# EasyEDA schematic Schematic.json

## Sheets
1 MAIN: TITLE: New Schematic; REV: 1.0; Date: 2018-05-05; Sheet: 1/1; Drawn By: ridvanaltun
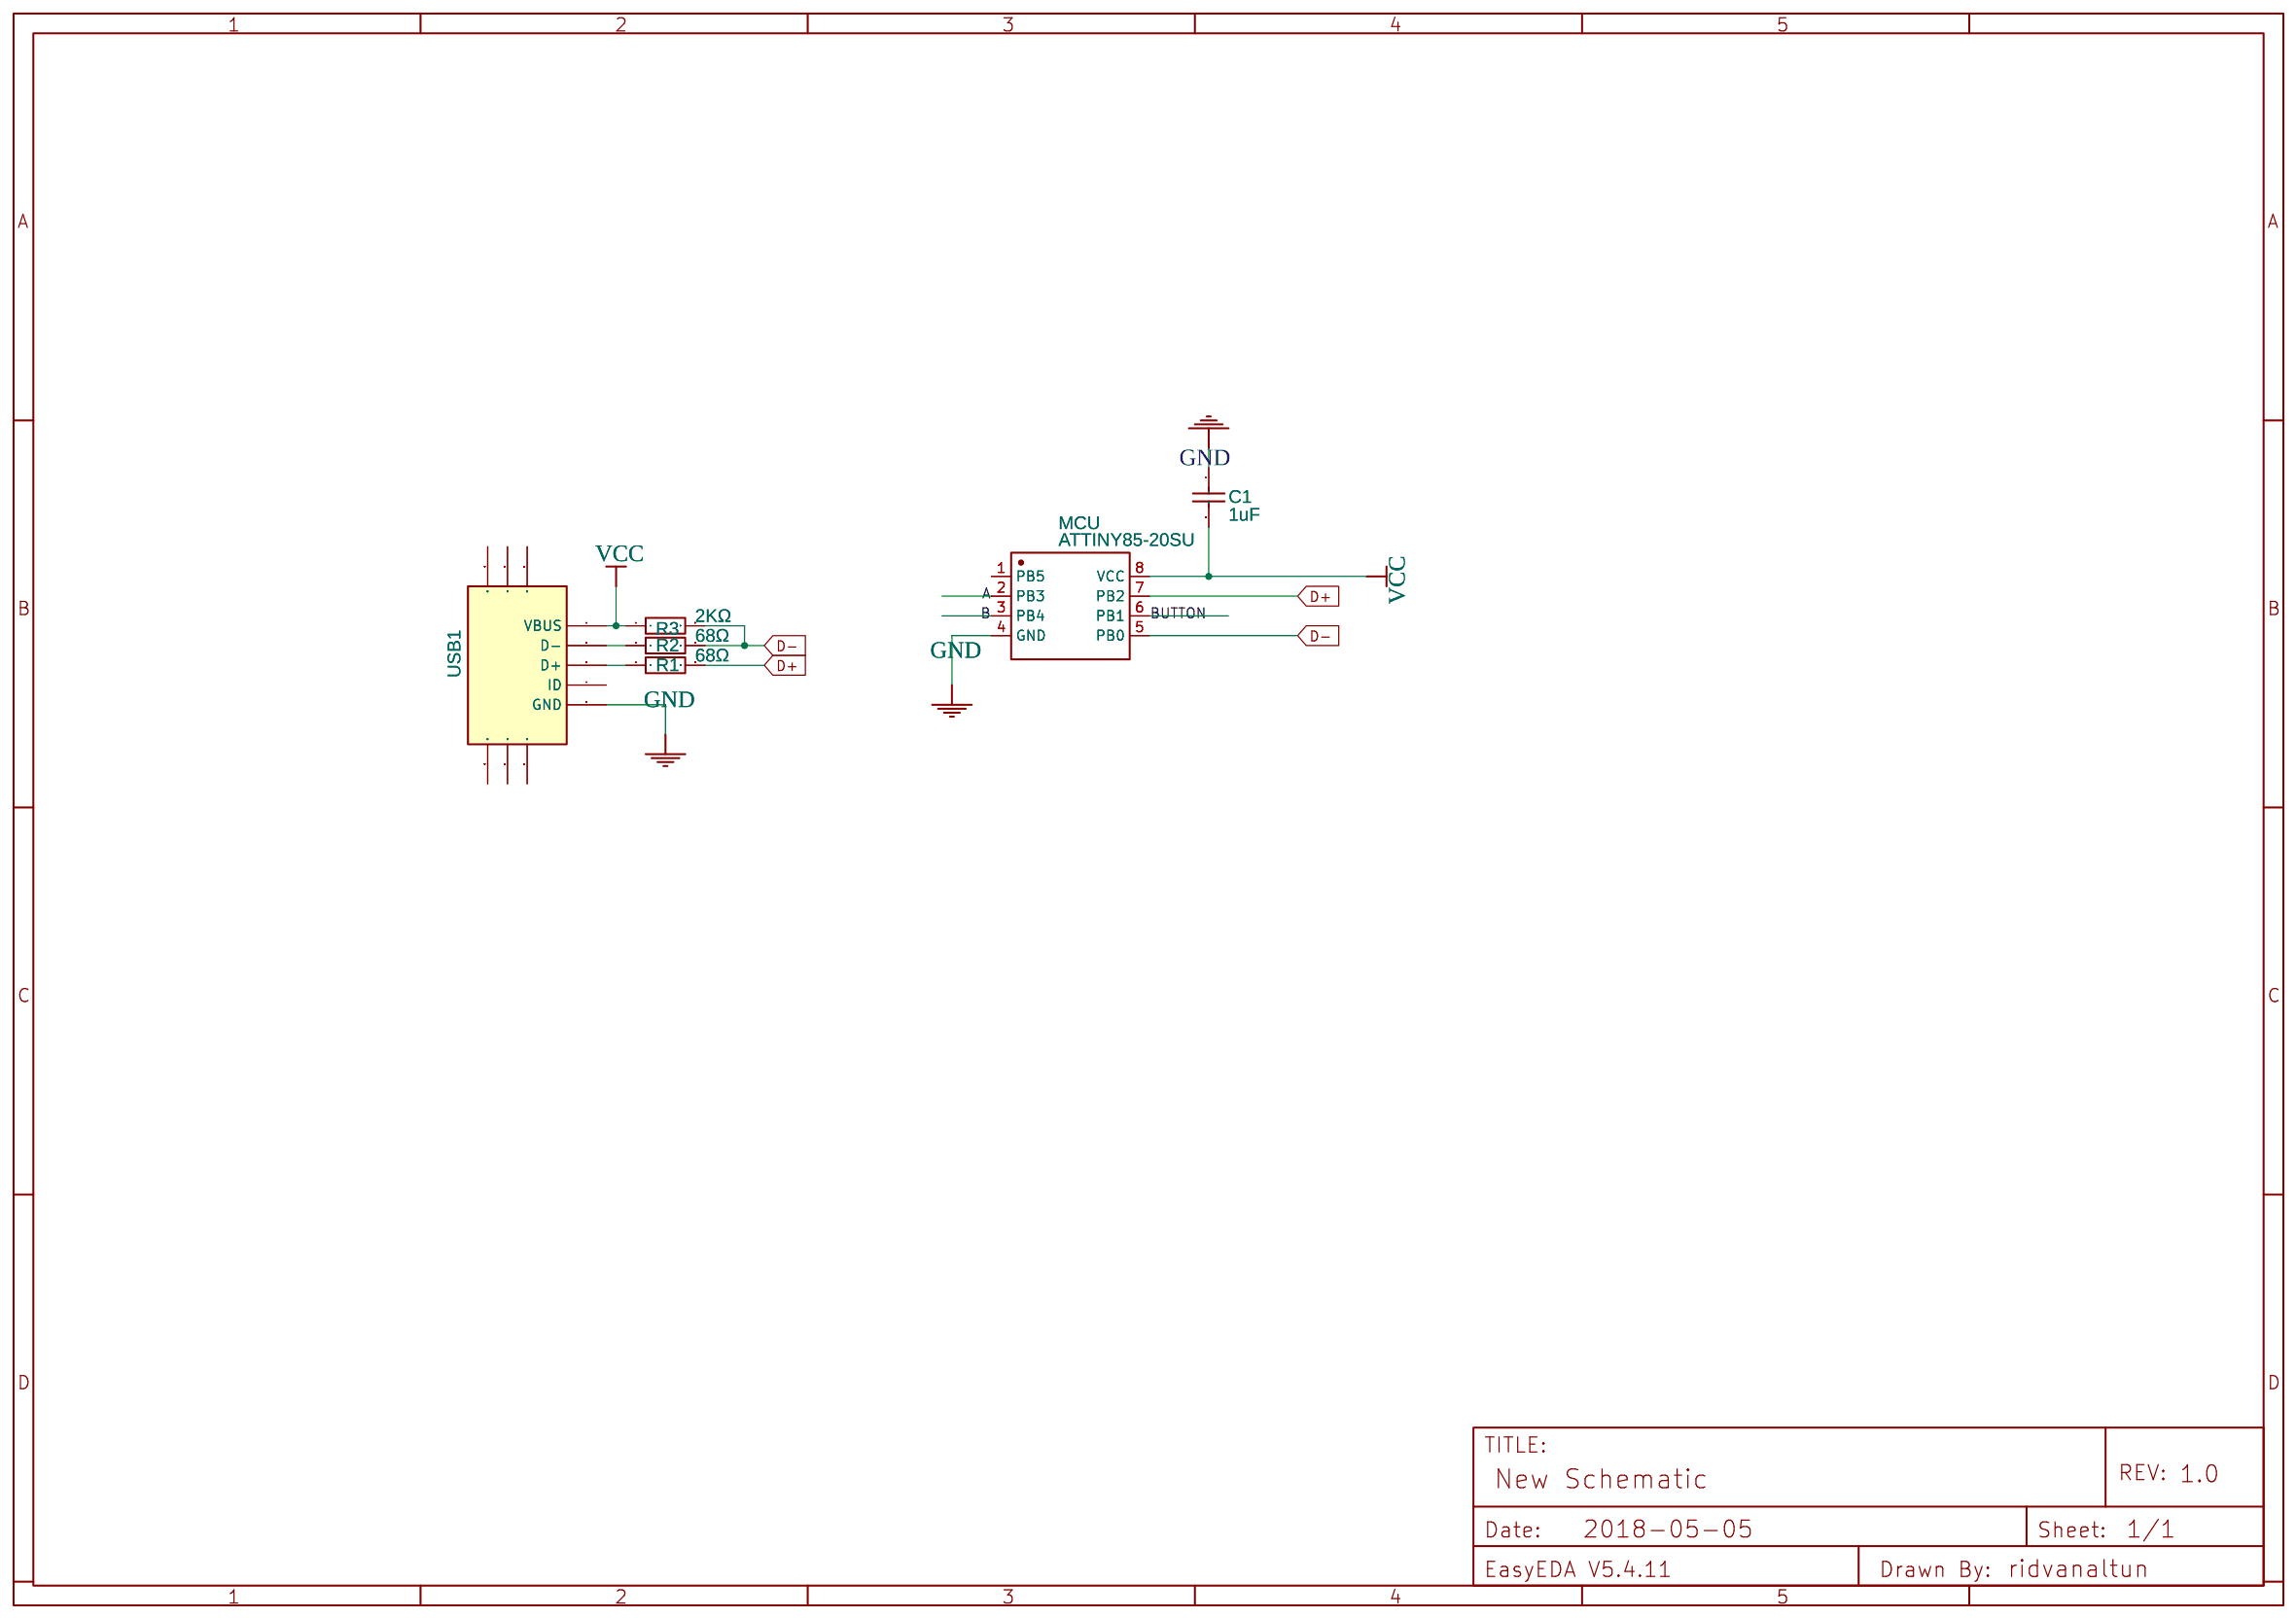
[diagram p0: MAIN]
2 ENCODER: TITLE: EC11 ENCODER
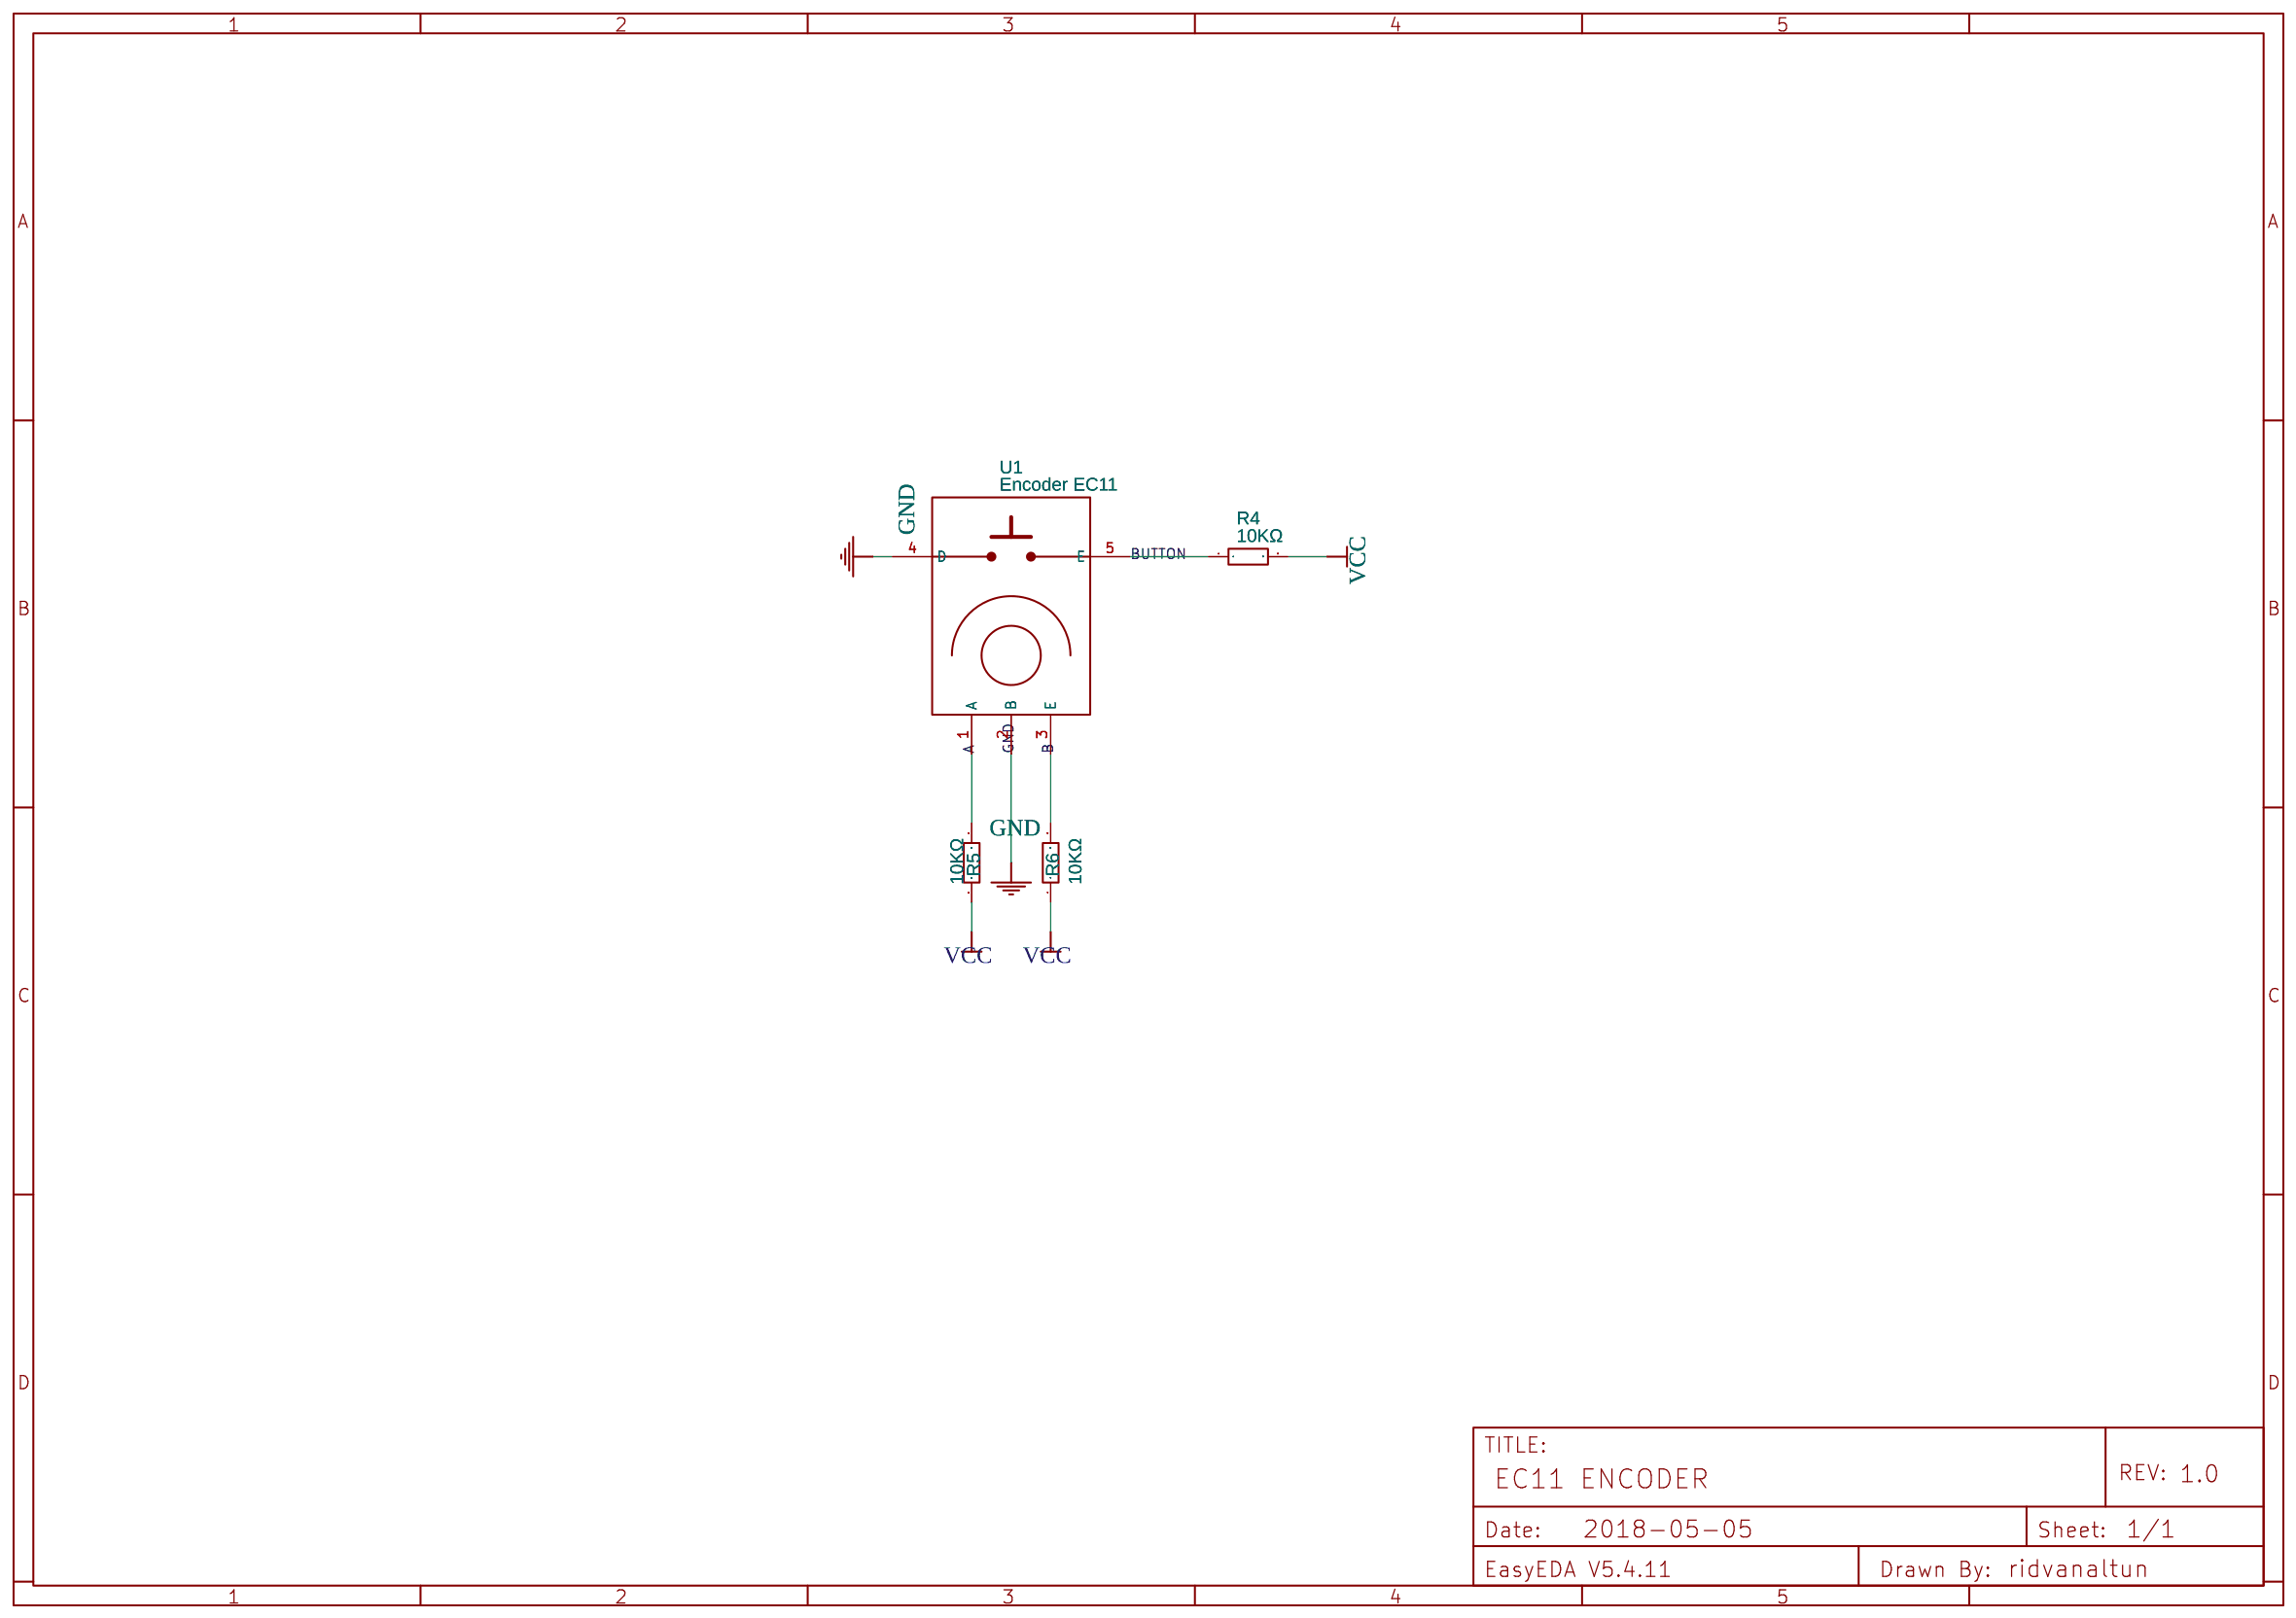
[diagram p1: ENCODER]

## Parts
sheet ENCODER
R4  10KΩ  [0603]
R5  10KΩ  [0603]
R6  10KΩ  [0603]
U1  Encoder EC11  [EC11]
sheet MAIN
C1  1uF  [0603]
MCU  ATTINY85-20SU  [SOIC-8_208MIL]
R1  68Ω  [0603]
R2  68Ω  [0603]
R3  2KΩ  [0603]
USB1  micro 5PAll posts are not guided Flat welding  [MICRO-USB-17]

## Library data of the parts
R4-R6 = TC0325F1002T5E: Supplier: LCSC; LCSC: C128781; Manufacturer: UniOhm; Contributor: LCSC
U1 = -: Contributor: sirgiovan; Supplier: Core SET; link: https://www.aliexpress.com/item/5Pcs-20-Position-360-Degree-Rotary-Encoder-Handle-Long-20MM-EC11-w-Push-Button-5Pin-With/32833853649.html?spm=a2g0s.9042311.0.0.JpMrMr
C1 = NFM18PS105R0J3D: Supplier: LCSC; Manufacturer: MuRata; LCSC: C98105
MCU = -: Supplier: LCSC; Manufacturer: MICROCHIP; LCSC: C89852
R1 R2 = 0603WAF680JT5E: Supplier: LCSC; Manufacturer: UniOhm; LCSC: C27592
R3 = RTT032001FTP: Supplier: LCSC; Manufacturer: RALEC; LCSC: C103390
USB1 = -: Supplier: LCSC; Manufacturer: ValuePro; LCSC: C77238

## Nets
GND: C1.1 MCU.4(GND) U1.2(B) U1.4(D) USB1.5(GND)
VCC: C1.2 MCU.8(VCC) R3.1 R4.2 R5.2 R6.1 USB1.1(VBUS)
A: MCU.2(PB3) R5.1 U1.1(A)
B: MCU.3(PB4) R6.2 U1.3(E)
BUTTON: MCU.6(PB1) R4.1 U1.5(E)
D+: MCU.7(PB2) R1.2
D-: MCU.5(PB0) R2.2 R3.2
Net-(R1-1): R1.1 USB1.3(D+)
Net-(R2-1): R2.1 USB1.2(D-)

Not connected (* = marked no-connect by the designer): MCU 1(PB5); USB1 0(MTN6) 4(ID)
